# EAGLE design untitled (EAGLE 6.5.0)
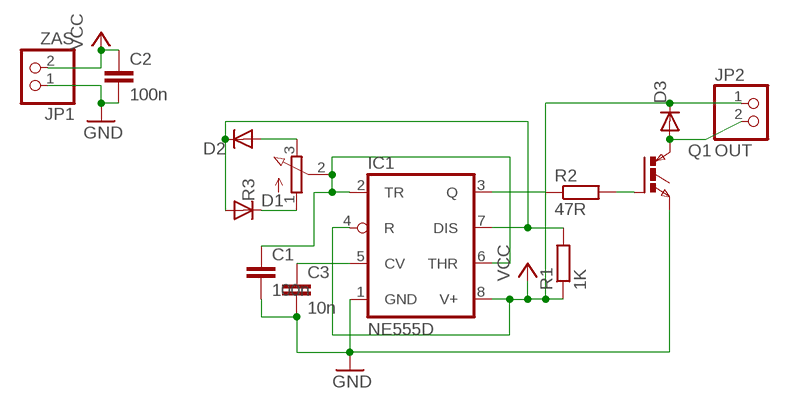
[diagram p0: schematic, sheet 1]

## Parts
C1  100n  C-EUC1206  [C1206]
C2  100n  C-EUC1206  [C1206]
C3  10n  C-EUC1206  [C1206]
D1  DIODE-MINIMELF  [MINIMELF]
D2  DIODE-MINIMELF  [MINIMELF]
D3  DIODE-MINIMELF  [MINIMELF]
IC1  NE555D  [SO08]
JP1  ZAS  PINHD-1X2  [1X02]
JP2  OUT  PINHD-1X2  [1X02]
Q1  IGBTTO252_STM  [TO252_STM]
R1  1K  R-EU_R1206  [R1206]
R2  47R  R-EU_R1206  [R1206]
R3  3RP/1610N  [3RP/1610N]

## Nets
GND: C1.2 C2.2 C3.2 IC1.1(GND) JP1.1 Q1.3(E)
N$1: C1.1 IC1.2(TR) IC1.6(THR) R3.2(S)
N$2: D1.C R3.1(A)
N$3: D2.A R3.3(E)
N$5: D1.A D2.C IC1.7(DIS) R1.2
N$6: IC1.3(Q) R2.1
N$7: Q1.1(G) R2.2
N$9: C3.1 IC1.5(CV)
N$11: D3.A JP2.2 Q1.2(C)
VCC: C2.1 D3.C IC1.4(R) IC1.8(V+) JP1.2 JP2.1 R1.1

## Library data of the parts
C1-C3 = rcl:C-EU: CAPACITOR, European symbol
D1-D3 = diode:DIODE-: DIODE
IC1 = linear:*555: TIMER
JP1 JP2 = pinhead:PINHD-1X2: PIN HEADER
Q1 = IGBT:IGBT: IGBT
R1 R2 = rcl:R-EU_: RESISTOR, European symbol
R3 = pot:3RP/1610N: 16mm Potentiometer one level Source: http://www.alphapotentiometers.net/html/16mm_pot_2.html

## Board
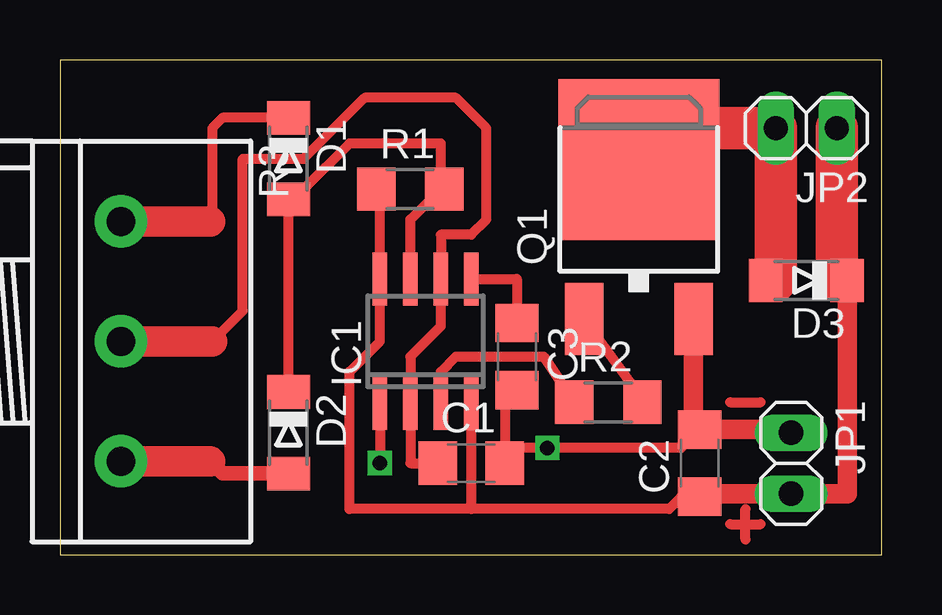
[diagram p1: board, top side]
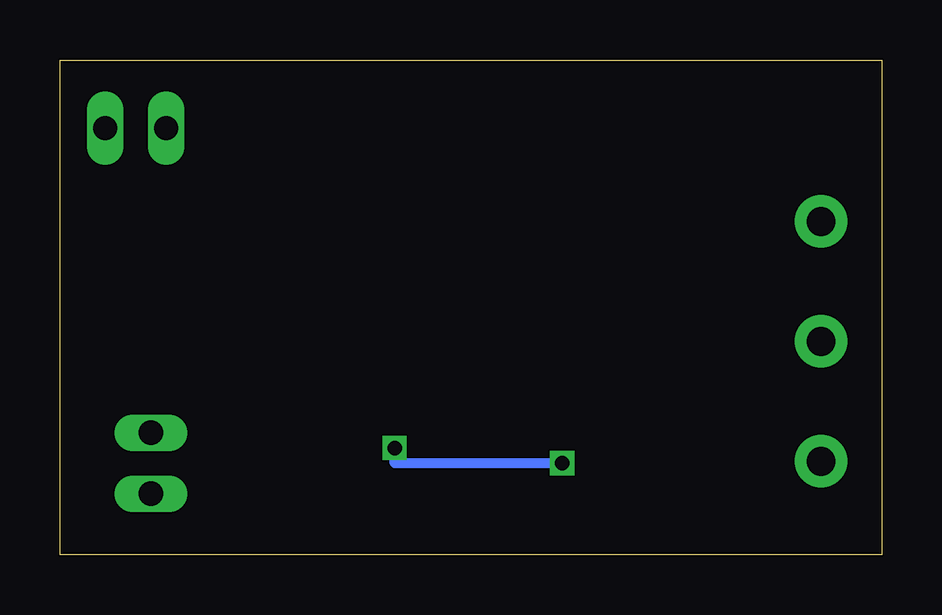
[diagram p2: board, bottom side, seen from below]

Size 34.27 x 20.62 mm. Coordinates in mm from the lower left corner, seen from the top.
Outline: 0,0 34.27,0 34.27,20.62 0,20.62 0,0
Copper layers (1*16): Top 0.035mm / dielectric 1.5mm / Bottom 0.035mm
Design rules "default": minimum track width 12mil, minimum drill 24mil, track to track 16mil, track to pad 16mil, pad to pad 16mil, via to via 16mil, smd to smd 12mil, copper to edge 40mil, drill to drill 8mil, minimum pad ring 10mil, minimum via ring 8mil, stop-mask expansion 4mil, vias tented up to drill 0mil, thermal gap 10mil

### Footprints (pad centres in the part's own frame; a part is rotated, then mirrored left to right if it is on the bottom)
C1206 = smd 1.6 x 1.8: 1 -1.4,0; 2 1.4,0
MINIMELF = smd 1.4 x 1.8: A 1.7,0; C -1.7,0
SO08 = smd 0.6 x 2.2: 1 -1.905,-2.6; 2 -0.635,-2.6; 3 0.635,-2.6; 4 1.905,-2.6; 5 1.905,2.6; 6 0.635,2.6; 7 -0.635,2.6; 8 -1.905,2.6
1X02 = drill 1.016 long: 1 -1.27,0; 2 1.27,0
TO252_STM = smd 1.6 x 3: 1 -2.28,-4.153; 3 2.28,-4.153 | smd 6.7 x 6.7: 2 0,2.5
R1206 = smd 1.6 x 1.803: 1 -1.422,0; 2 1.422,0
3RP/1610N = drill 1.2 pad 2.184: 1 -5,0; 2 0,0; 3 5,0

### Placement (x,y rotation side)
C1  17.14,3.81 0 top
C2  26.67,3.81 90 top
C3  19.05,8.26 270 top
D1  9.52,16.51 270 top
D2  9.52,5.08 270 top
D3  31.12,11.43 180 top
IC1  15.24,8.89 0 top
JP1  30.48,3.81 270 top
JP2  31.12,17.78 180 top
Q1  24.13,13.97 0 top
R1  14.61,15.24 0 top
R2  22.86,6.35 0 top
R3  2.54,8.89 270 top

### Tracks (layer width: path | path; a pad name or v marks a point on that pad's centre or on a via)
GND  (via drill 0.6)
  Top 0.406: 30.48,5.21 JP1.1 | 26.41,5.21 C2.2 25.91,4.45 v20.32,4.45 18.55,4.45 C1.2 18.55,6.86 C3.2 | IC1.1 v13.34,3.81
  Top 0.813: C2.2 30.48,5.21 | 26.41,5.21 Q1.3
  Bottom 0.406: v13.34,3.81 20.32,3.81 v20.32,4.45
N$1
  Top 0.406: C1.1 14.61,3.81 IC1.2 14.61,8.26 15.88,9.53 IC1.6 15.88,13.34 17.14,13.34 17.78,13.97 17.78,17.78 16.51,19.05 12.7,19.05 10.16,16.51 7.62,16.51 7.62,10.16 6.35,8.89
  Top 1.27: R3.2 6.35,8.89
N$2
  Top 0.406: D1.C 6.78,18.21 6.35,17.78 6.35,13.97 6.27,13.89
  Top 1.27: R3.1 6.27,13.89
N$3
  Top 0.61: D2.A 6.78,3.38 6.27,3.89
  Top 1.27: R3.3 6.27,3.89
N$4
  Top 0.406: 27.94,6.35 29.21,6.35
N$5
  Top 0.406: D2.C D1.A 9.95,15.24 10.16,15.24 12.07,17.14 15.88,17.14 15.88,15.24 | IC1.7 14.61,13.97 15.88,15.24 | 15.88,15.24 R1.2
N$6
  Top 0.406: R2.1 20.17,8.26 16.51,8.26 15.88,7.62 IC1.3
N$7
  Top 0.406: R2.2 24.39,6.35 Q1.1
N$8
  Top 0.406: 27.94,1.27 29.21,1.27
N$9
  Top 0.406: IC1.5 19.05,11.49 C3.1
N$10
  Top 0.406: 28.57,0.64 28.57,1.91
N$11
  Top 0.406: D3.A 29.84,11.43 | 24.13,17.78 Q1.2
  Top 1.778: 29.84,11.43 JP2.2 24.13,17.78
VCC
  Top 0.406: 13.34,11.43 IC1.8 | 26.67,2.54 C2.1 25.91,2.41 25.4,1.91 17.14,1.91 | D3.C 32.38,11.43 | IC1.4 17.14,1.91 | 17.14,1.91 12.07,1.91 12.07,7.62 13.34,8.89 IC1.8 | IC1.8 13.34,15.09 R1.1
  Top 0.813: 26.67,2.54 JP1.2 32.81,2.54 D3.C
  Top 1.778: 32.38,11.43 JP2.1